# Altium schematic sheet ZeroCrossingDetector.SchDoc
size A4; SheetNumber: 5; SheetTotal: 5
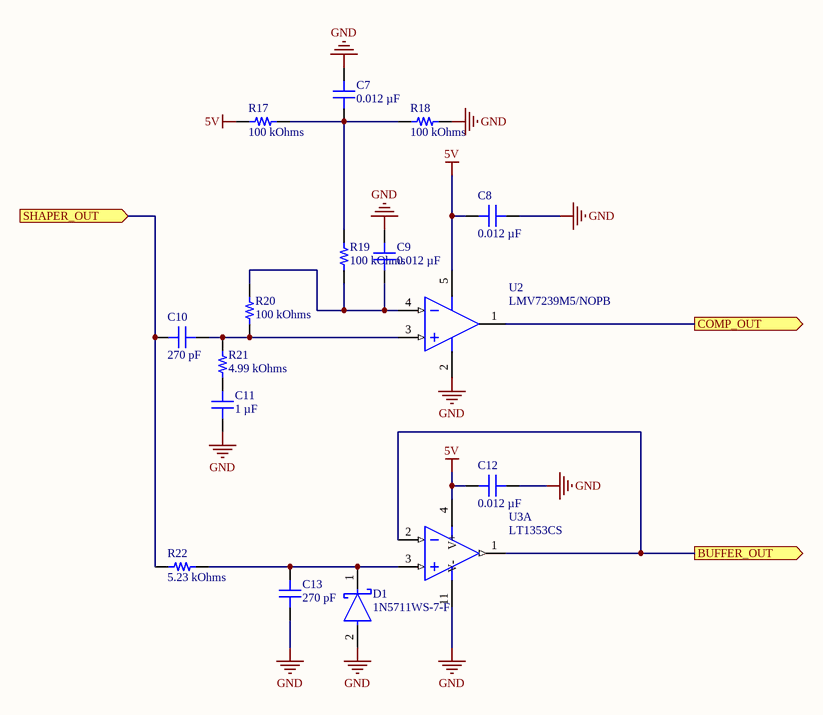
[diagram p0: ZeroCrossingDetector.SchDoc]

## Parts
C7  0.012 µF  [CAP 0603_1608]
C8  0.012 µF  [CAP 0603_1608]
C9  0.012 µF  [CAP 0603_1608]
C10  270 pF  [CAP 0603_1608]
C11  1 µF  [CAP 0603_1608]
C12  0.012 µF  [CAP 0603_1608]
C13  270 pF  [CAP 0603_1608]
D1  1N5711WS-7-F  [FP-SOD323-MFG]
R17  100 kOhms  [RES 0603_1608]
R18  100 kOhms  [RES 0603_1608]
R19  100 kOhms  [RES 0603_1608]
R20  100 kOhms  [RES 0603_1608]
R21  4.99 kOhms  [RES 0603_1608]
R22  5.23 kOhms  [RES 0603_1608]
U2  LMV7239M5/NOPB  [DBV0005A_L]
U3  LT1353CS  [LT-S-14_N]  (part A of 4)

## Ports
BUFFER_OUT (out), COMP_OUT (out), SHAPER_OUT (in)

## Nets
5V: C8.2 C12.2 R17.1 U2.5(V+) U3.4(V+)
GND: C7.1 C8.1 C9.1 C11.1 C12.1 C13.1 D1.2(A) R18.2 U2.2(V-) U3.11(V-)
BUFFER_OUT: U3.1(OUT_A) U3.2(-IN_A) ; port BUFFER_OUT
COMP_OUT: U2.1(VOUT) ; port COMP_OUT
SHAPER_OUT: C10.1 R22.1 ; port SHAPER_OUT
NetC7_2: C7.2 R17.2 R18.1 R19.2
NetC9_2: C9.2 R19.1 R20.2 U2.4(IN-)
NetC10_2: C10.2 R20.1 R21.2 U2.3(IN+)
NetC13_2: C13.2 D1.1(C) R22.2 U3.3(+IN_A)

Not connected (* = marked no-connect by the designer): C11 2; R21 1

## Library data of the parts
C7-C9 C12 = CC0603KRX7R7BB123: CAP CER 0.012UF 16V X7R 0603; manufacturer: Yageo; Tolerance: ±10%; Part Number: CC0603KRX7R7BB123; Value: 0.012 µF; Applications: General Purpose; Capacitance: 0.012 µF; componentlink1description: Datasheet; componentlink1url: https://www.yageo.com/upload/media/product/productsearch/datasheet/mlcc/UPY-GPHC_X7R_6.3V-to-50V_18.pdf; componentlink2description: DigiKey Link; componentlink2url: https://www.digikey.com/en/products/detail/yageo/CC0603KRX7R7BB123/5883754; Device Package: 0603 (1608 Metric); lastupdated: 3/15/2022 3:14:47 AM; Lifecycle Status: Active; Minimum Order: 1; Mounting Type: Surface Mount, MLCC; Operating Temperature: -55°C ~ 125°C; Package / Case: 0603 (1608 Metric); packaging: TapeAndReel; partid: 12340; Part Status: Active; price: 0.01; series: CC; Size / Dimension: 0.063" L x 0.031" W (1.60mm x 0.80mm); Supplier 1: DigiKey; Supplier Part Number 1: 311-3370-1-ND; Temperature Coefficient: X7R; Thickness (Max): 0.035" (0.90mm); Voltage - Rated: 16V
C10 C13 = VJ0603D271JXJQJHT: CAP CER 270 PF 16V C0G 0603; manufacturer: Vishay Vitramon; Temperature Coefficient: C0G, NP0; Tolerance: ±5%; Part Number: VJ0603D271JXJQJHT; Value: 270 pF; Applications: RF, Microwave, High Frequency; Capacitance: 270 pF; componentlink1description: Datasheet; componentlink1url: https://www.vishay.com/docs/45239/vjhifreqht.pdf; componentlink2description: DigiKey Link; componentlink2url: https://www.digikey.com/en/products/detail/vishay-vitramon/VJ0603D271JXJQJHT/14292682; Device Package: 0603 (1608 Metric); Features: High Temperature; lastupdated: 3/15/2022 3:13:58 AM; Lifecycle Status: Active; Minimum Order: 1; Mounting Type: Surface Mount, MLCC; Operating Temperature: -55°C ~ 200°C; Package / Case: 0603 (1608 Metric); packaging: TapeAndReel; partid: 34314; Part Status: Active; price: 0.10; series: VJ HIFREQ HT; Size / Dimension: 0.063" L x 0.031" W (1.60mm x 0.80mm); Supplier 1: DigiKey; Supplier Part Number 1: 720-VJ0603D271JXJQJHTCT-ND; Thickness (Max): 0.037" (0.94mm); Voltage - Rated: 16V
C11 = CC0603KRX5R7BB105: CAP CER 1UF 16V X5R 0603; manufacturer: Yageo; Tolerance: ±10%; Part Number: CC0603KRX5R7BB105; Value: 1 µF; Applications: General Purpose; Capacitance: 1 µF; componentlink1description: Datasheet; componentlink1url: https://www.yageo.com/upload/media/product/productsearch/datasheet/mlcc/UPY-GPHC_X5R_4V-to-50V_25.pdf; componentlink2description: DigiKey Link; componentlink2url: https://www.digikey.com/en/products/detail/yageo/CC0603KRX5R7BB105/2833609; Device Package: 0603 (1608 Metric); lastupdated: 3/15/2022 3:14:47 AM; Lifecycle Status: Active; Minimum Order: 1; Mounting Type: Surface Mount, MLCC; Operating Temperature: -55°C ~ 85°C; Package / Case: 0603 (1608 Metric); packaging: TapeAndReel; partid: 12399; Part Status: Active; price: 0.01; series: CC; Size / Dimension: 0.063" L x 0.031" W (1.60mm x 0.80mm); Supplier 1: DigiKey; Supplier Part Number 1: 311-1444-1-ND; Temperature Coefficient: X5R; Thickness (Max): 0.035" (0.90mm); Voltage - Rated: 16V
D1 = CMP-12790-000032-1: DIODE SCHOTTKY 70V 150MW SOD323; Manufacturer: Diodes Inc; Value: 2pF; Standoff Height: 0.05mm; Max Junction Temp: +125°C; Forward Current: 15mA; Reverse Voltage: 49V; Category: Diode; Temperature: -55°C to +125°C; Digikey Description: DIODE SCHOTTKY 70V 150MW SOD323; Octopart: https://octopart.com/1n5711ws-7-f-diodes+inc.-323167; Manufacturer Part Number: 1N5711WS-7-F; Temperature Range High: +125°C; Lead Free: Yes; RoHS: TRUE; Device Class L2: Diodes; Height: 1.2mm; Automotive: No; Device Class L1: Discrete Semiconductors; Capacitance: 2pF; ComponentLink2URL: https://www.diodes.com/assets/Datasheets/ds31033.pdf; Temperature Range Low: -55°C; Max Repetitive Reverse Voltage: 70V; ComponentLink2Description: Datasheet; Package: SOD323; Device Class L3: Schottky Diodes; Mouser Description: Schottky Diodes & Rectifiers 70V 200mW; Footprint Url: https://www.diodes.com/assets/Package-Files/SOD323.pdf
R17-R20 = RCC0603100KFKEA: RCC0603 100 100K 1% ET1 E3; Manufacturer: Vishay Dale; Power (Watts): 0.2W, 1/5W; Temperature Coefficient: ±100ppm/°C; Part Number: RCC0603100KFKEA; Value: 100 kOhms; ComponentLink1Description: Datasheet; ComponentLink1URL: https://www.vishay.com/docs/20066/rcce3.pdf; ComponentLink2Description: DigiKey Link; ComponentLink2URL: https://www.digikey.com/en/products/detail/vishay-dale/RCC0603100KFKEA/12084243; Composition: Thick Film; Device Package: 0603 (1608 Metric); Features: Automotive AEC-Q200; Height - Seated (Max): 0.020" (0.50mm); LastUpdated: 3/15/2022 3:31:52 AM; Lifecycle Status: Active; Minimum Order: 1; Number of Terminations: 2; Operating Temperature: -55°C ~ 155°C; Package / Case: 0603 (1608 Metric); Packaging: TapeAndReel; PartId: 62891; Part Status: Active; Price: 0.01; Ratings: AEC-Q200; Resistance: 100 kOhms; Series: RCC e3; Size / Dimension: 0.061" L x 0.033" W (1.55mm x 0.85mm); Supplier 1: DigiKey; Supplier Part Number 1: 541-RCC0603100KFKEACT-ND; Supplier Device Package: 0603; Tolerance: ±1%
R21 = PTN0603Y4991BST1: PTN0603 10PPM 4.99K 0.1% S T1 E1; Manufacturer: Vishay Dale Thin Film; Power (Watts): 0.15W; Temperature Coefficient: ±10ppm/°C; Part Number: PTN0603Y4991BST1; Value: 4.99 kOhms; ComponentLink1Description: Datasheet; ComponentLink1URL: https://www.vishay.com/docs/60026/ptn.pdf; ComponentLink2Description: DigiKey Link; ComponentLink2URL: https://www.digikey.com/en/products/detail/vishay-dale-thin-film/PTN0603Y4991BST1/12820670; Composition: Thin Film; Device Package: 0603 (1608 Metric); Features: Anti-Sulfur, Moisture Resistant, Non-Inductive; Height - Seated (Max): 0.020" (0.51mm); LastUpdated: 3/15/2022 3:31:51 AM; Lifecycle Status: Active; Minimum Order: 1; Number of Terminations: 2; Operating Temperature: -55°C ~ 155°C; Package / Case: 0603 (1608 Metric); Packaging: TapeAndReel; PartId: 62736; Part Status: Active; Price: 0.27; Resistance: 4.99 kOhms; Series: PTN; Size / Dimension: 0.064" L x 0.032" W (1.63mm x 0.81mm); Supplier 1: DigiKey; Supplier Part Number 1: 764-PTN0603Y4991BST1CT-ND; Supplier Device Package: 0603; Tolerance: ±0.1%
R22 = TNPW06035K23BEEA: RES 5.23K OHM 0.1% 1/10W 0603; Manufacturer: Vishay Dale; Power (Watts): 0.125W, 1/8W; Temperature Coefficient: ±25ppm/°C; Part Number: TNPW06035K23BEEA; Value: 5.23 kOhms; ComponentLink1Description: Datasheet; ComponentLink1URL: http://www.vishay.com/docs/28758/tnpw_e3.pdf; ComponentLink2Description: DigiKey Link; ComponentLink2URL: http://digikey.com/product-detail/en/vishay-dale/TNPW06035K23BEEA/541-3697-1-ND/7355057; Composition: Thin Film; Device Package: 0603 (1608 Metric); Features: Anti-Sulfur, Automotive AEC-Q200, Moisture Resistant; Height - Seated (Max): 0.022" (0.55mm); LastUpdated: 3/15/2022 3:32:19 AM; Lifecycle Status: Active; Minimum Order: 1; Number of Terminations: 2; Operating Temperature: -55°C ~ 155°C; Package / Case: 0603 (1608 Metric); Packaging: TapeAndReel; PartId: 25777; Part Status: Active; Price: 0.11; Ratings: AEC-Q200; Resistance: 5.23 kOhms; Series: TNPW e3; Size / Dimension: 0.063" L x 0.033" W (1.60mm x 0.85mm); Supplier 1: DigiKey; Supplier Part Number 1: 541-3697-1-ND; Supplier Device Package: 0603; Tolerance: ±0.1%
U2 = CMP-0055-01129-3: 45 nsec, Ultra Low Power, Low Voltage, Rail-to-Rail Input Comparator with Open-Drain/Push-Pull Output, 5-pin SOT-23, Pb-Free; Manufacturer: Texas Instruments; CompType: Amplifiers; PackageTopMarking: C20A*XTT; PowerWise: Y; PackageDescription: Molded SOT-23, .115 x .063 x .040 in Body, 5 Lead, .0375 in Pitch; RoHS: Y; ComponentLink1Description: Datasheet URL; PinCount: 5; Package Reference: DBV0005A; ComponentLink1URL: http://www.ti.com/general/docs/lit/getliterature.tsp?genericPartNumber=LMV7239&fileType=pdf
U3 = CMP-0359-01665-2: Quad Channel, High Speed Precision Operational Amplifier, 3 MHz Typical GBW, 200 V/us Typical SR, 5 to 36 V, 14-Pin SOIC (S-14), Commerical; Linear Technology Part Number: LT1353; Manufacturer: Linear Technology; Vos (mV) Typical: 0.2; SR (V/us) Typical: 200; GBW (MHz) Typical: 3; Vs Max (V): 36; Channels (#): 4; Vs Min (V): 5; Is (mA) Typical: 0.25; DatasheetVersion: Rev. A; Type: VFB; PackageVersion: Rev G; Mounting Technology: Surface Mount; PackageReference: LT-S-14; ComponentLink3Description: Package Specification; PackageDescription: 14-Lead Plastic Small Outline, Body 8.65 x 3.90 mm, Pitch 1.27 mm; ComponentLink2URL: http://cds.linear.com/docs/en/datasheet/1352_53fa.pdf; ComponentLink3URL: http://cds.linear.com/docs/en/packaging/05081610_G_S14.pdf; ComponentLink1URL: http://www.linear.com/; ComponentLink1Description: Manufacturer URL; PartNumber: LT1353CS; RevisionNote: URLs updated; ComponentLink2Description: Datasheet